# Altium schematic sheet 启动模式.SchDoc
size A4
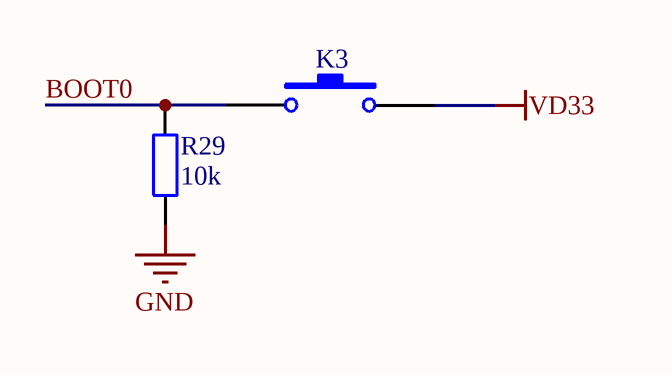
[diagram p0: 启动模式.SchDoc]

## Parts
K3  �ᴥ����  [SW6X6]  (value not drawn)
R29  10k  [LC-0805_R]

## Nets
GND: R29.1
VD33: K3.2
BOOT0: K3.1 R29.2

## Library data of the parts
K3 = SW-PB: �ᴥ����6��6mm,�Ľǲ��; Published: 24-Mar-1999; LatestRevisionDate: 17-Jul-2002; LatestRevisionNote: Re-released for DXP Platform.; PackageReference: SPST-2; Publisher: Altium Limited; PackageDescription: Switch; 2 Leads
R29 = R: 10k��,0805,��5%